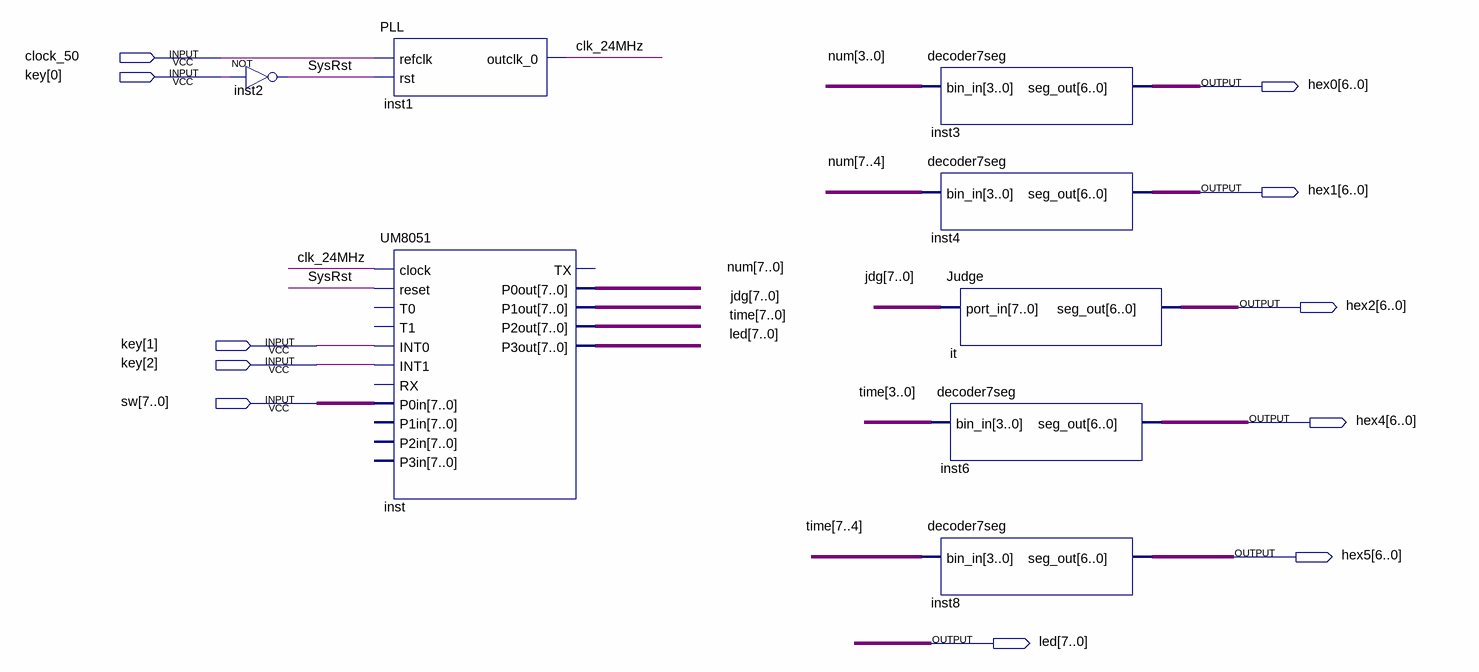
[diagram p0: schematic sheet]
// Quartus schematic lab2.bdf as structural Verilog: 8 symbols, 11 pins
module lab2 (
  input  clock_50,
  input  [2:0] key,
  input  [7:0] sw,
  output [6:0] hex0,
  output [6:0] hex1,
  output [6:0] hex2,
  output [6:0] hex4,
  output [6:0] hex5,
  output [7:0] led
);

  wire clk_24MHz, SysRst;
  wire [7:0] jdg, num, \time ;

  not inst2 (SysRst, key[0]);
  PLL inst1 (.refclk(clock_50), .rst(SysRst), .outclk_0(clk_24MHz));
  UM8051 inst (
    .clock(clk_24MHz), .reset(SysRst), .INT0(key[1]), .INT1(key[2]), .P0in(sw), .P0out(num), .P1out(jdg),
    .P2out(\time ), .P3out(led));  // open: T0, T1, RX, P1in, P2in, P3in, TX
  decoder7seg inst3 (.bin_in(num[3:0]), .seg_out(hex0));
  decoder7seg inst4 (.bin_in(num[7:4]), .seg_out(hex1));
  Judge it (.port_in(jdg), .seg_out(hex2));
  decoder7seg inst6 (.bin_in(\time [3:0]), .seg_out(hex4));
  decoder7seg inst8 (.bin_in(\time [7:4]), .seg_out(hex5));
endmodule
